# Altium project GMAX0505_MB.PrjPcb
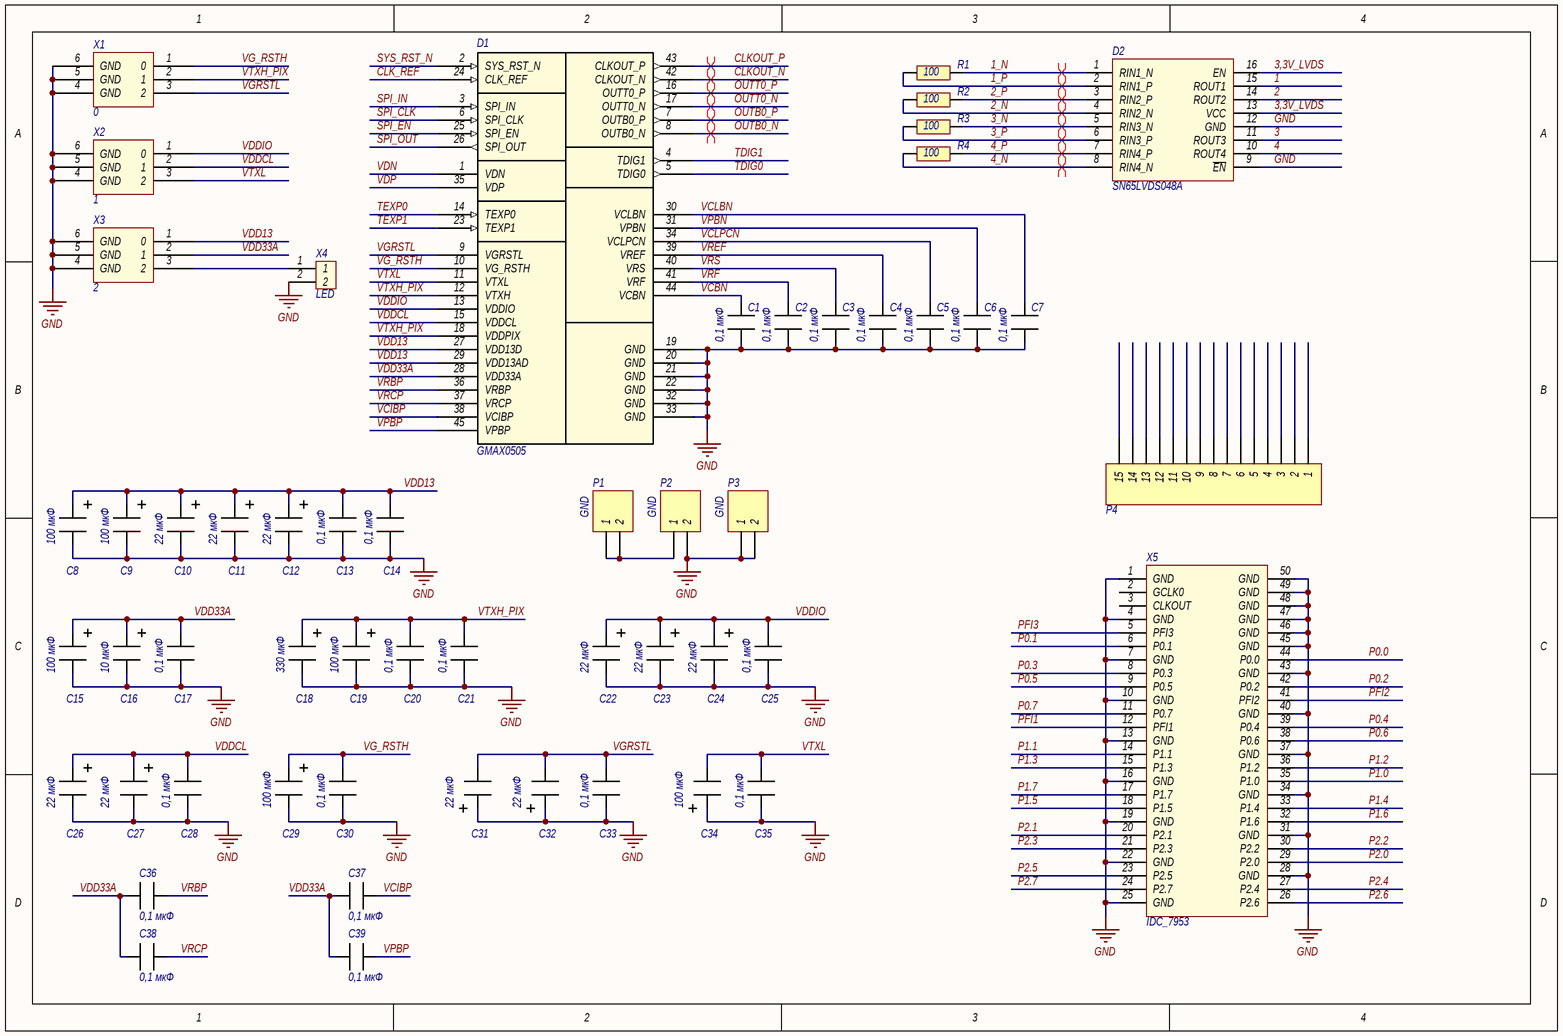
[diagram p0: Sheet1_GMAX0505_MB.SchDoc]
1 sheet, 54 parts. Net scope: global (net labels, ports and power ports of the same name join across sheets).
Board file: GMAX0505_MB.PcbDoc

## Sheet Sheet1_GMAX0505_MB.SchDoc
size A4; SheetNumber: 1; SheetTotal: 1

### Parts
C1  0,1 мкФ  [CAP_SMALL]
C2  0,1 мкФ  [CAP_SMALL]
C3  0,1 мкФ  [CAP_SMALL]
C4  0,1 мкФ  [CAP_SMALL]
C5  0,1 мкФ  [CAP_SMALL]
C6  0,1 мкФ  [CAP_SMALL]
C7  0,1 мкФ  [CAP_SMALL]
C8  100 мкФ  [Cap_0612_electrolitic]
C9  100 мкФ  [Cap_0612_electrolitic]
C10  22 мкФ  [Cap_0511_electrolitic]
C11  22 мкФ  [Cap_0511_electrolitic]
C12  22 мкФ  [Cap_0511_electrolitic]
C13  0,1 мкФ  [CAP_SMALL]
C14  0,1 мкФ  [CAP_SMALL]
C15  100 мкФ  [Cap_0612_electrolitic]
C16  10 мкФ  [Cap_0511_electrolitic]
C17  0,1 мкФ  [CAP_SMALL]
C18  330 мкФ  [Cap_1013_electrolitic]
C19  100 мкФ  [Cap_0612_electrolitic]
C20  0,1 мкФ  [CAP_SMALL]
C21  0,1 мкФ  [CAP_SMALL]
C22  22 мкФ  [Cap_0511_electrolitic]
C23  22 мкФ  [Cap_0511_electrolitic]
C24  22 мкФ  [Cap_0511_electrolitic]
C25  0,1 мкФ  [CAP_SMALL]
C26  22 мкФ  [Cap_0511_electrolitic]
C27  22 мкФ  [Cap_0511_electrolitic]
C28  0,1 мкФ  [CAP_SMALL]
C29  100 мкФ  [Cap_0612_electrolitic]
C30  0,1 мкФ  [CAP_SMALL]
C31  22 мкФ  [Cap_0511_electrolitic]
C32  22 мкФ  [Cap_0511_electrolitic]
C33  0,1 мкФ  [CAP_SMALL]
C34  100 мкФ  [Cap_0612_electrolitic]
C35  0,1 мкФ  [CAP_SMALL]
C36  0,1 мкФ  [CAP_SMALL]
C37  0,1 мкФ  [CAP_SMALL]
C38  0,1 мкФ  [CAP_SMALL]
C39  0,1 мкФ  [CAP_SMALL]
D1  GMAX0505  [GMAX0505_MEZ]
D2  SN65LVDS048A  [SN65LVDS048A (4LVDS)]
P1  GND  [HDR1X2]
P2  GND  [HDR1X2]
P3  GND  [HDR1X2]
P4  Header 15  [HDR1X15]  (value not drawn)
R1  100  [RES]
R2  100  [RES]
R3  100  [RES]
R4  100  [RES]
X1  0  [POWER]
X2  1  [POWER]
X3  2  [POWER]
X4  LED  [KLEMMNIK_2]
X5  IDC_7953  [IDC_7953]

### Nets
GND: C1.2 C2.2 C3.2 C4.2 C5.2 C6.2 C7.2 C8.2 C9.2 C10.2 C11.2 C12.2 C13.2 C14.2 C15.2 C16.2 C17.2 C18.2 C19.2 C20.2 C21.2 C22.2 C23.2 C24.2 C25.2 C26.2 C27.2 C28.1 C29.2 C30.2 C31.1 C32.1 C33.1 C34.1 C35.2 D1.19(GND) D1.20(GND) D1.21(GND) D1.22(GND) D1.32(GND) D1.33(GND) D2.9(~{EN}) D2.12(GND) P2.2 P3.1 P3.2 X1.4(GND) X1.5(GND) X1.6(GND) X2.4(GND) X2.5(GND) X2.6(GND) X3.4(GND) X3.5(GND) X3.6(GND) X4.2 X5.1(GND) X5.4(GND) X5.7(GND) X5.10(GND) X5.13(GND) X5.16(GND) X5.19(GND) X5.22(GND) X5.25(GND) X5.28(GND) X5.31(GND) X5.34(GND) X5.37(GND) X5.40(GND) X5.43(GND) X5.45(GND) X5.46(GND) X5.47(GND) X5.48(GND) X5.49(GND) X5.50(GND)
1: D2.15(ROUT1)
1_N: D2.1(RIN1_N) R1.1
1_P: D2.2(RIN1_P) R1.2
2: D2.14(ROUT2)
2_N: D2.4(RIN2_N) R2.2
2_P: D2.3(RIN2_P) R2.1
3: D2.11(ROUT3)
3,3V_LVDS: D2.13(VCC) D2.16(EN)
3_N: D2.5(RIN3_N) R3.1
3_P: D2.6(RIN3_P) R3.2
4: D2.10(ROUT4)
4_N: D2.8(RIN4_N) R4.2
4_P: D2.7(RIN4_P) R4.1
CLK_REF: D1.24(CLK_REF)
CLKOUT_N: D1.42(CLKOUT_N)
CLKOUT_P: D1.43(CLKOUT_P)
OUTB0_N: D1.8(OUTB0_N)
OUTB0_P: D1.7(OUTB0_P)
OUTT0_N: D1.17(OUTT0_N)
OUTT0_P: D1.16(OUTT0_P)
P0.0: X5.44(P0.0)
P0.1: X5.6(P0.1)
P0.2: X5.42(P0.2)
P0.3: X5.8(P0.3)
P0.4: X5.39(P0.4)
P0.5: X5.9(P0.5)
P0.6: X5.38(P0.6)
P0.7: X5.11(P0.7)
P1.0: X5.35(P1.0)
P1.1: X5.14(P1.1)
P1.2: X5.36(P1.2)
P1.3: X5.15(P1.3)
P1.4: X5.33(P1.4)
P1.5: X5.18(P1.5)
P1.6: X5.32(P1.6)
P1.7: X5.17(P1.7)
P2.0: X5.29(P2.0)
P2.1: X5.20(P2.1)
P2.2: X5.30(P2.2)
P2.3: X5.21(P2.3)
P2.4: X5.27(P2.4)
P2.5: X5.23(P2.5)
P2.6: X5.26(P2.6)
P2.7: X5.24(P2.7)
PFI1: X5.12(PFI1)
PFI2: X5.41(PFI2)
PFI3: X5.5(PFI3)
SPI_CLK: D1.6(SPI_CLK)
SPI_EN: D1.25(SPI_EN)
SPI_IN: D1.3(SPI_IN)
SPI_OUT: D1.26(SPI_OUT)
SYS_RST_N: D1.2(SYS_RST_N)
TDIG0: D1.5(TDIG0)
TDIG1: D1.4(TDIG1)
TEXP0: D1.14(TEXP0)
TEXP1: D1.23(TEXP1)
VCBN: C1.1 D1.44(VCBN)
VCIBP: C37.1 D1.38(VCIBP)
VCLBN: C7.1 D1.30(VCLBN)
VCLPCN: C5.1 D1.34(VCLPCN)
VDD13: C8.1 C9.1 C10.1 C11.1 C12.1 C13.1 C14.1 D1.27(VDD13D) D1.29(VDD13AD) X3.1(0)
VDD33A: C15.1 C16.1 C17.1 C36.2 C37.2 C38.2 C39.2 D1.28(VDD33A) X3.2(1)
VDDCL: C26.1 C27.1 C28.2 D1.15(VDDCL) X2.2(1)
VDDIO: C22.1 C23.1 C24.1 C25.1 D1.13(VDDIO) X2.1(0)
VDN: D1.1(VDN)
VDP: D1.35(VDP)
VG_RSTH: C29.1 C30.1 D1.10(VG_RSTH) X1.1(0)
VGRSTL: C31.2 C32.2 C33.2 D1.9(VGRSTL) X1.3(2)
VPBN: C6.1 D1.31(VPBN)
VPBP: C39.1 D1.45(VPBP)
VRBP: C36.1 D1.36(VRBP)
VRCP: C38.1 D1.37(VRCP)
VREF: C4.1 D1.39(VREF)
VRF: C2.1 D1.41(VRF)
VRS: C3.1 D1.40(VRS)
VTXH_PIX: C18.1 C19.1 C20.1 C21.1 D1.12(VTXH) D1.18(VDDPIX) X1.2(1)
VTXL: C34.2 C35.1 D1.11(VTXL) X2.3(2)
NetP1_1: P1.1 P1.2 P2.1
NetX3_3: X3.3(2) X4.1

Not connected (* = marked no-connect by the designer): P4 1 2 3 4 5 6 7 8 9 10 11 12 13 14 15; X5 2(GCLK0) 3(CLKOUT)

### Layout directives
differential pair: 1_N, 1_P, 2_N, 2_P, 3_N, 3_P, 4_N, 4_P, CLKOUT_N, CLKOUT_P, OUTB0_N, OUTB0_P, OUTT0_N, OUTT0_P

### Library data of the parts
C1-C7 C13 C14 C17 C20 C21 C25 C28 C30 C33 C35-C39 = CAP_SMALL
C8 C9 C15 C19 C29 C34 = Cap_electrolotoc_0612
C10-C12 C16 C22-C24 C26 C27 C31 C32 = Cap_electrolotoc_0511
C18 = Cap_electrolotoc_1013
D1 = GMAX0505_MEZ
D2 = SN65LVDS048A (4LVDS)
P1-P3 = Header 2: Header, 2-Pin; LatestRevisionDate: 17-Jul-2002; LatestRevisionNote: Re-released for DXP Platform.; Publisher: Altium Limited
P4 = Header 15: Header, 15-Pin; LatestRevisionDate: 17-Jul-2002; LatestRevisionNote: Re-released for DXP Platform.; Publisher: Altium Limited
R1-R4 = RES
X1-X3 = POWER
X4 = KLEMMNIK_2